# EAGLE schematic Inline DC Panel Meter - Display Holder (EAGLE 9.6.2)
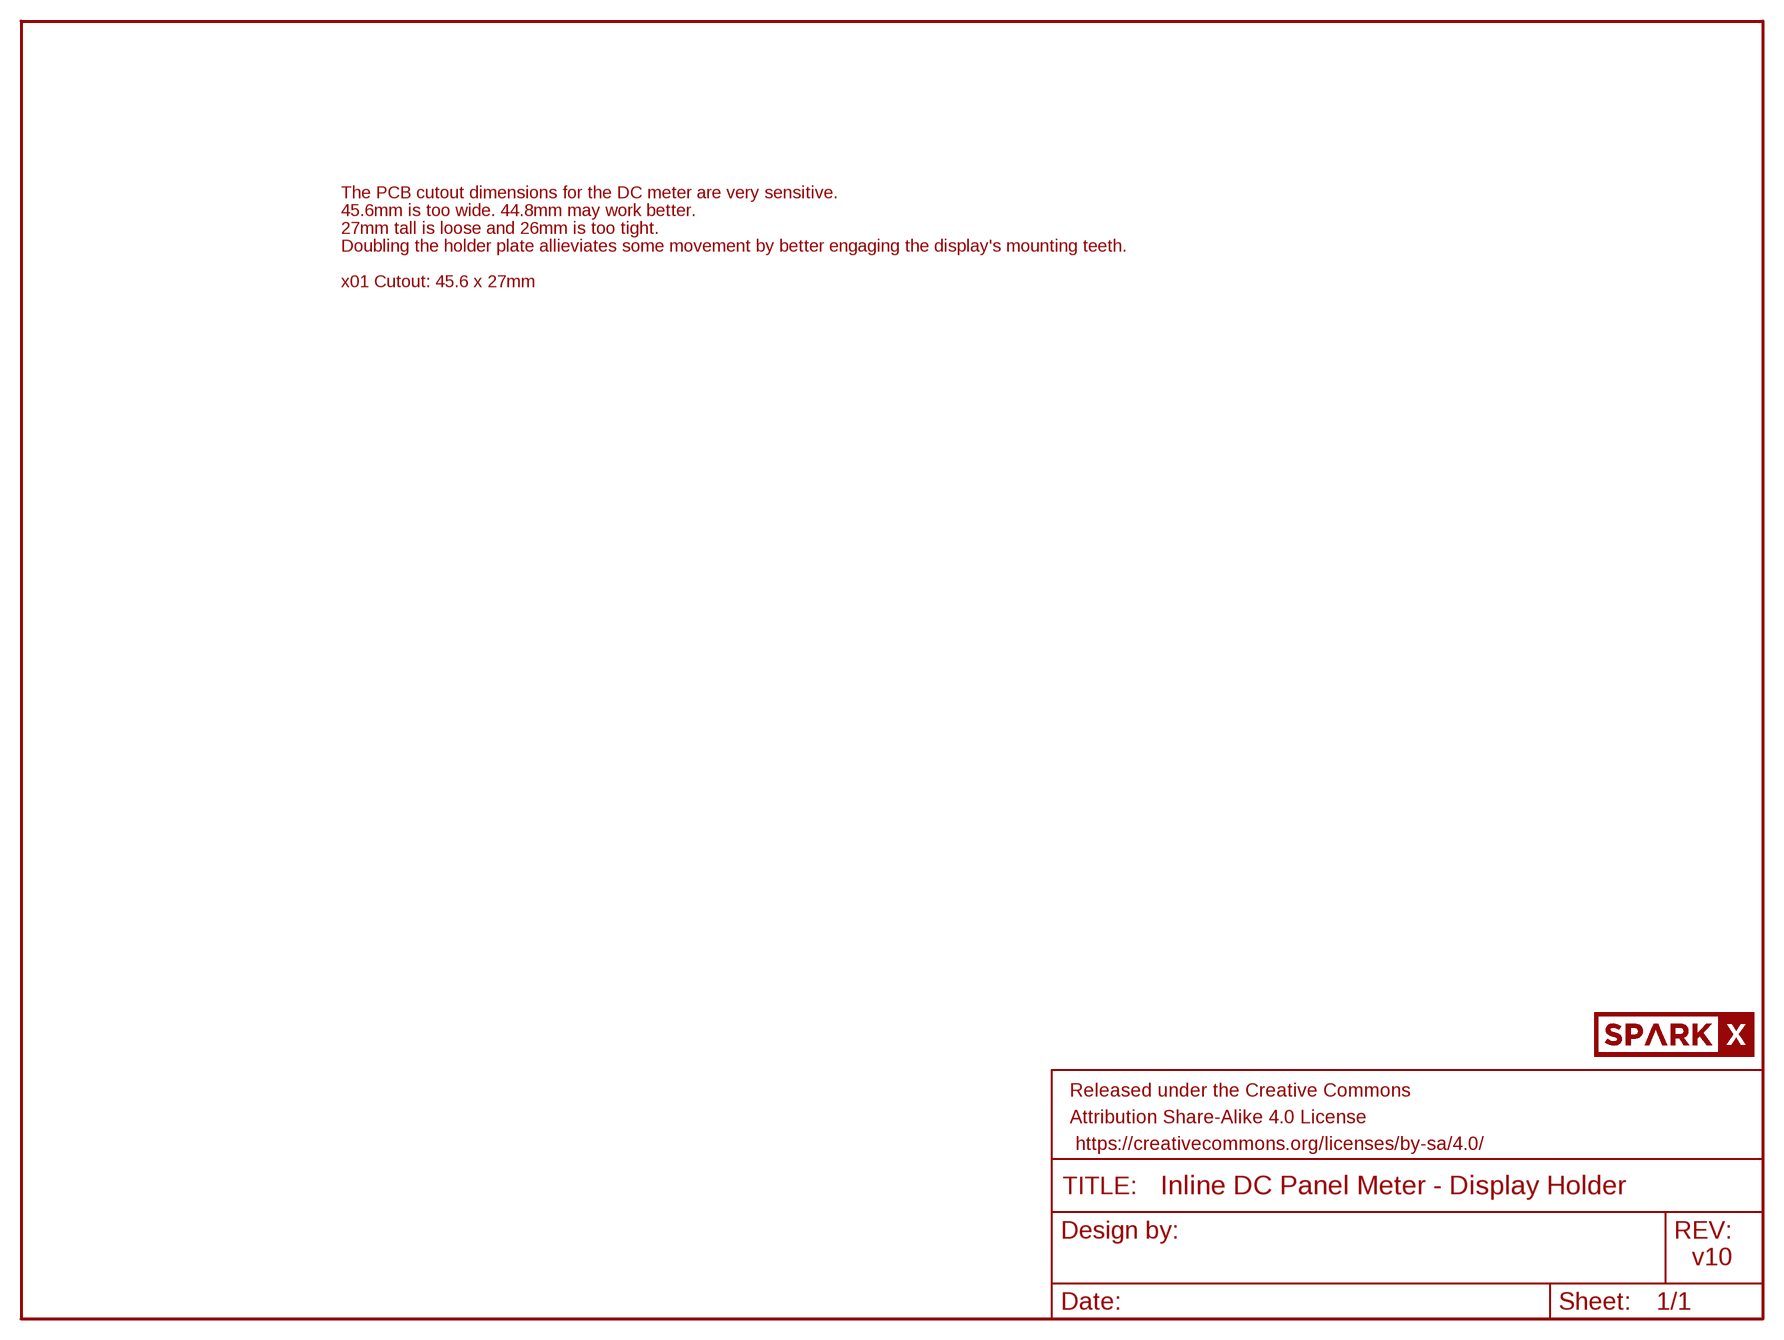
[diagram p0: schematic, sheet 1]

## Parts
FRAME1  FRAME-LETTER  [CREATIVE_COMMONS]
U$1  SPARKX-LOGO4  [SPARKX-MEDIUM]

## Notes on the sheet
- The PCB cutout dimensions for the DC meter are very sensitive.
- 45.6mm is too wide. 44.8mm may work better.
- 27mm tall is loose and 26mm is too tight.
- Doubling the holder plate allieviates some movement by better engaging the display's mounting teeth.
- x01 Cutout: 45.6 x 27mm
- v10

## Library data of the parts
FRAME1 = SparkFun-Aesthetics:FRAME-LETTER: Schematic Frame - Letter Standard 8.5x11 US Letter frame
U$1 = SparkX:SPARKX-LOGO

## Net classes
1 power: width 0.254 mm